# Altium schematic sheet Power.SchDoc: FlightControlBoard-Power
size A4; SheetNumber: 4; SheetTotal: 5
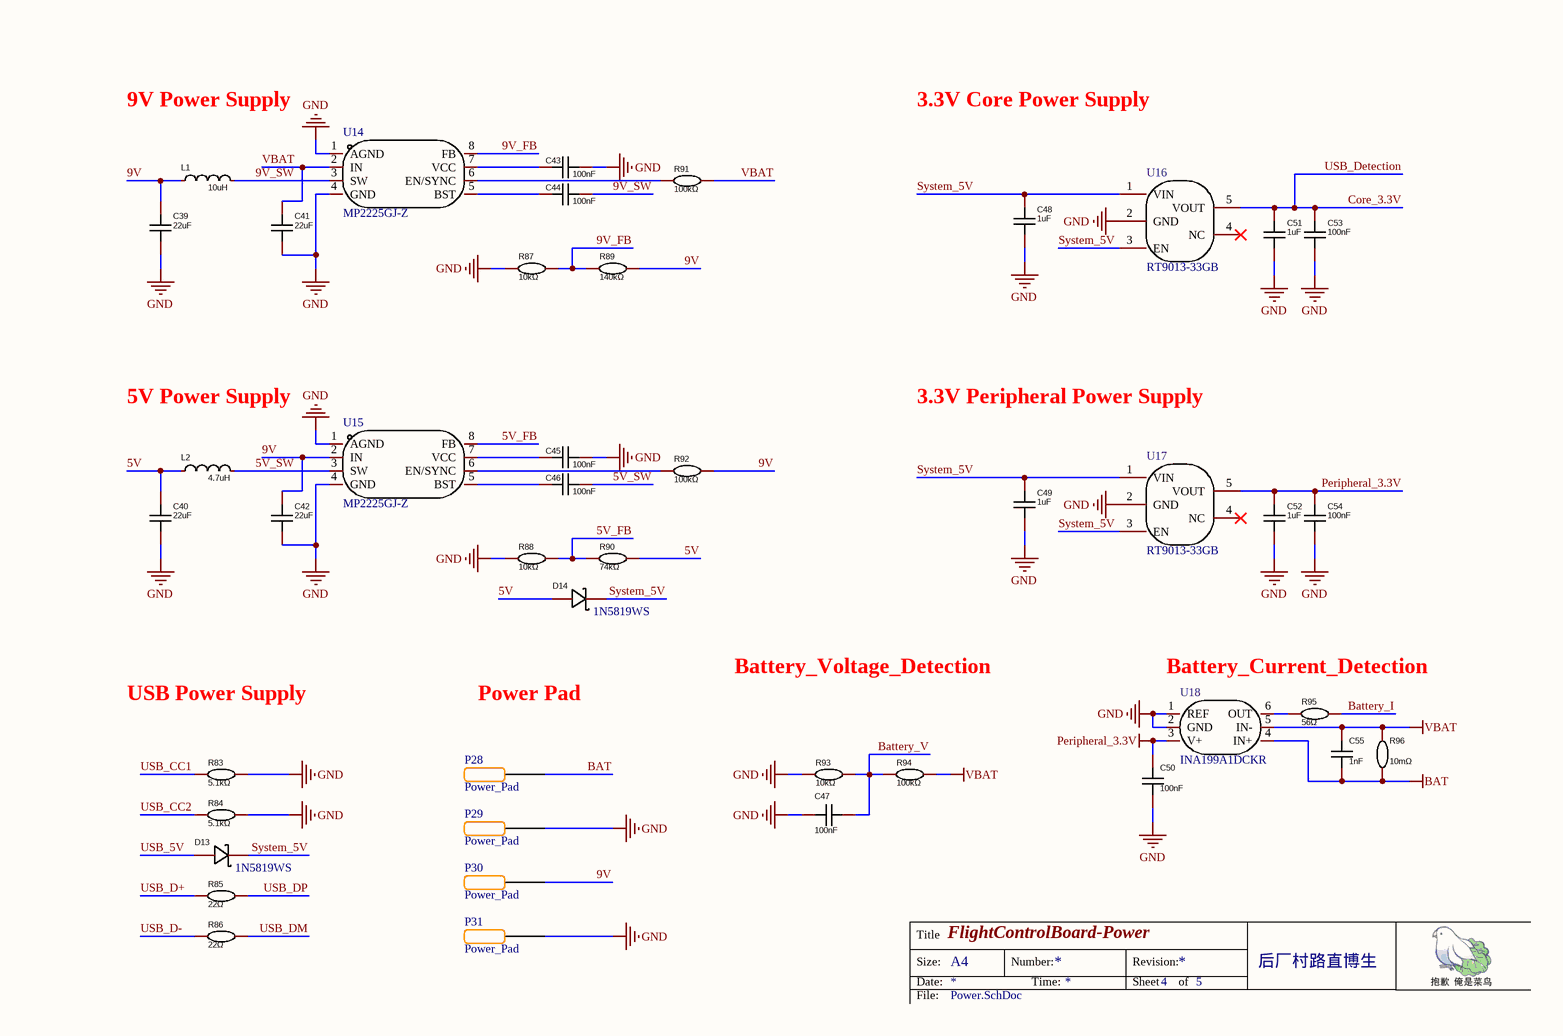
[diagram p0: Power.SchDoc]

## Parts
C39  22uF  [C0603]
C40  22uF  [C0603]
C41  22uF  [C0603]
C42  22uF  [C0603]
C43  100nF  [C0201]
C44  100nF  [C0201]
C45  100nF  [C0201]
C46  100nF  [C0201]
C47  100nF  [C0201]
C48  1uF  [C0402]
C49  1uF  [C0402]
C50  100nF  [C0201]
C51  1uF  [C0402]
C52  1uF  [C0402]
C53  100nF  [C0201]
C54  100nF  [C0201]
C55  1nF  [C0201]
D13  1N5819WS  [SOD-323]
D14  1N5819WS  [SOD-323]
L1  value 10uH  [IND-SMD_L4.0-W4.0]  (hidden comment: FHD4020S-100MT)
L2  value 4.7uH  [IND-SMD_L4.0-W4.0]  (hidden comment: FHD4020S-4R7MT)
P28  Power_Pad  [POWER HALF HOLE]
P29  Power_Pad  [POWER HALF HOLE]
P30  Power_Pad  [POWER HALF HOLE]
P31  Power_Pad  [POWER HALF HOLE]
R83  5.1kΩ  [R0201]
R84  5.1kΩ  [R0201]
R85  22Ω  [R0201]
R86  22Ω  [R0201]
R87  10kΩ  [R0201]
R88  10kΩ  [R0201]
R89  140kΩ  [R0201]
R90  74kΩ  [R0201]
R91  100kΩ  [R0201]
R92  100kΩ  [R0201]
R93  10kΩ  [R0201]
R94  100kΩ  [R0201]
R95  56Ω  [R0201]
R96  10mΩ  [R0805]
U14  MP2225GJ-Z  [SOT-23-8]
U15  MP2225GJ-Z  [SOT-23-8]
U16  RT9013-33GB  [SOT-23-5]
U17  RT9013-33GB  [SOT-23-5]
U18  INA199A1DCKR  [SOT-323-6]

## Nets
BAT: C55.2 P28.1 R96.1 U18.4(IN+)
GND: C39.2 C40.2 C41.2 C42.2 C43.1 C45.1 C47.2 C48.2 C49.2 C50.2 C51.2 C52.2 C53.2 C54.2 P29.1 P31.1 R83.1 R84.2 R87.1 R88.1 R93.1 U14.1(AGND) U14.4(GND) U15.1(AGND) U15.4(GND) U16.2(GND) U17.2(GND) U18.1(REF) U18.2(GND)
Peripheral_3.3V: C50.1 C52.1 C54.1 U17.5(VOUT) U18.3(V+)
VBAT: C41.1 C55.1 R91.2 R94.2 R96.2 U14.2(IN) U18.5(IN-)
5V: C40.1 D14.2(A) L2.1 R90.2
5V_FB: R88.2 R90.1 U15.8(FB)
5V_SW: C46.1 L2.2 U15.3(SW)
9V: C39.1 C42.1 L1.1 P30.1 R89.2 R92.2 U15.2(IN)
9V_FB: R87.2 R89.1 U14.8(FB)
9V_SW: C44.1 L1.2 U14.3(SW)
Battery_I: R95.2
Battery_V: C47.1 R93.2 R94.1
Core_3.3V: C51.1 C53.1 U16.5(VOUT)  [also labelled USB_Detection]
System_5V: C48.1 C49.1 D13.1(K) D14.1(K) U16.1(VIN) U16.3(EN) U17.1(VIN) U17.3(EN)
USB_5V: D13.2(A)
USB_CC1: R83.2
USB_CC2: R84.1
USB_D+: R85.1
USB_D-: R86.1
USB_DM: R86.2
USB_DP: R85.2
NetC43_2: C43.2 U14.7(VCC)
NetC44_2: C44.2 U14.5(BST)
NetC45_2: C45.2 U15.7(VCC)
NetC46_2: C46.2 U15.5(BST)
NetR91_1: R91.1 U14.6(EN/SYNC)
NetR92_1: R92.1 U15.6(EN/SYNC)
NetR95_1: R95.1 U18.6(OUT)

Not connected (* = marked no-connect by the designer): U16 4(NC)*; U17 4(NC)*

## Notes on the sheet
- 9V Power Supply
- 3.3V Core Power Supply
- 5V Power Supply
- 3.3V Peripheral Power Supply
- USB Power Supply
- Power Pad
- Battery_Voltage_Detection
- Battery_Current_Detection
- Title
- Size:
- Date:
- A4
- Number:
- Time:
- Revision:
- Sheet
- of
- 后厂村路直博生
- File:

## Library data of the parts
C39-C55 = CC0603KRX7R9BB104: Add into BOM: yes; Convert to PCB: yes
  C39-C42: Name: 22uF; Value: 22uF
  C43-C46 C53 C54: Name: 100nF; Value: 100nF
  C47 C50: Value: 100nF
  C48 C49 C51 C52: Name: 1uF; Value: 1uF
  C55: Value: 1nF
D13 D14 = 1N5819WS: Manufacturer: Hottech(合科泰); Device: 1N5819WS_C191023; Add into BOM: yes; Forward Voltage (Vf@If): 600mV@1A; Reverse Voltage (Vr): 40V; Average Rectified Current (Io): 1A; Symbol: 1N5819WS; Supplier: LCSC; Supplier Part: C191023; Manufacturer Part: 1N5819WS; JLCPCB Part Class: Basic Part; LCSC Part Name: 电压:40V 电流:1A; Supplier Footprint: SOD-323; Datasheet: https://atta.szlcsc.com/upload/public/pdf/source/20220428/3CB86FD8D28D653594B4E35F9D5AEFD9.pdf; Convert to PCB: yes
L1 L2 = SDFL2012T220KTF: Manufacturer: cjiang(长江微电); Add into BOM: yes; Tolerance: ±10%; Rated Current: 5mA; DC Resistance (DCR): 1.1Ω; Supplier Footprint: SMD,4x4mm; JLCPCB Part Class: Basic Part; Datasheet: https://atta.szlcsc.com/upload/public/pdf/source/20210816/855F4348312D259031B87CBCF31BE802.pdf; Supplier: LCSC; Convert to PCB: yes; Saturation Current (Isat): -; Q @ Freq: -; Frequency - Self Resonant: -; Ratings: -
  L1: Name: 10uH; Symbol: FHD4020S-100MT; Device: FHD4020S-100MT; LCSC Part Name: 10uH ±20% 3.5A; Supplier Part: C602032; Manufacturer Part: FHD4020S-100MT
  L2: Name: 4.7uH; Symbol: FHD4020S-4R7MT; Device: FHD4020S-4R7MT; LCSC Part Name: 4.7uH ±20% 4.9A; Supplier Part: C602031; Manufacturer Part: FHD4020S-4R7MT
R83-R96 = 0603WAF1002T5E: Add into BOM: yes; Convert to PCB: yes
  R83 R84: Name: 5.1kΩ; Value: 5.1kΩ
  R85 R86: Name: 22Ω; Value: 22Ω
  R87 R88 R93: Name: 10kΩ; Value: 10kΩ
  R89: Name: 140kΩ; Value: 140kΩ
  R90: Name: 74kΩ; Value: 74kΩ
  R91 R92 R94: Name: 100kΩ; Value: 100kΩ
  R95: Name: 56Ω; Value: 56Ω
  R96: Name: 10mΩ; Value: 10mΩ; Supplier Part: C163089
U14 U15 = MP2225GJ-Z: Symbol: MP2225GJ-Z_C9900010483; Add into BOM: yes; Device: MP2225GJ-Z; LCSC Part Name: MP2225GJ-Z; Supplier Part: C9900010483; Manufacturer Part: MP2225GJ-Z; Supplier Footprint: SOT23-8M; JLCPCB Part Class: 扩展库; Datasheet: https://atta.szlcsc.comnull; Supplier: LCSC; Convert to PCB: yes
U16 U17 = RT9013-33GB: Manufacturer: RICHTEK(立锜); Add into BOM: yes; Output Type: 固定; Output Polarity: 正; Number of Outputs: 1; Maximum Input Voltage: 5.5V; Output Voltage: 3.3V; Dropout Voltage: 400mV@(500mA); Quiescent Current (Ground Current): 50uA; Output Current: 500mA; Power Supply Rejection Ratio (PSRR): 50dB@(10kHz); Name: RT9013-33GB; Symbol: RT9013-33GB; Device: RT9013-33GB; LCSC Part Name: 输入5.5V 输出3.3V 500mA; Supplier Part: C47773; Manufacturer Part: RT9013-33GB; Supplier Footprint: SOT-23-5; JLCPCB Part Class: Extended Part; Datasheet: https://atta.szlcsc.com/upload/public/pdf/source/20150504/1457707282459.pdf; Supplier: LCSC; Convert to PCB: yes; Noise: -; Feature: -; Operating Temperature: -40℃~+85℃
U18 = INA199A1DCKR: Manufacturer: TI(德州仪器); Add into BOM: yes; Supply Current: 300uA; Supply Voltage: -300mV~26V; Name: INA199A1DCKR; Symbol: INA199A1DCKR; Device: INA199A1DCKR; LCSC Part Name: INA199A1DCKR; Supplier Part: C59135; Manufacturer Part: INA199A1DCKR; Supplier Footprint: SOT-323-6; JLCPCB Part Class: Extended Part; Datasheet: https://www.ti.com/cn/lit/gpn/ina199; Supplier: LCSC; Convert to PCB: yes; Operating Temperature: -40℃~+125℃